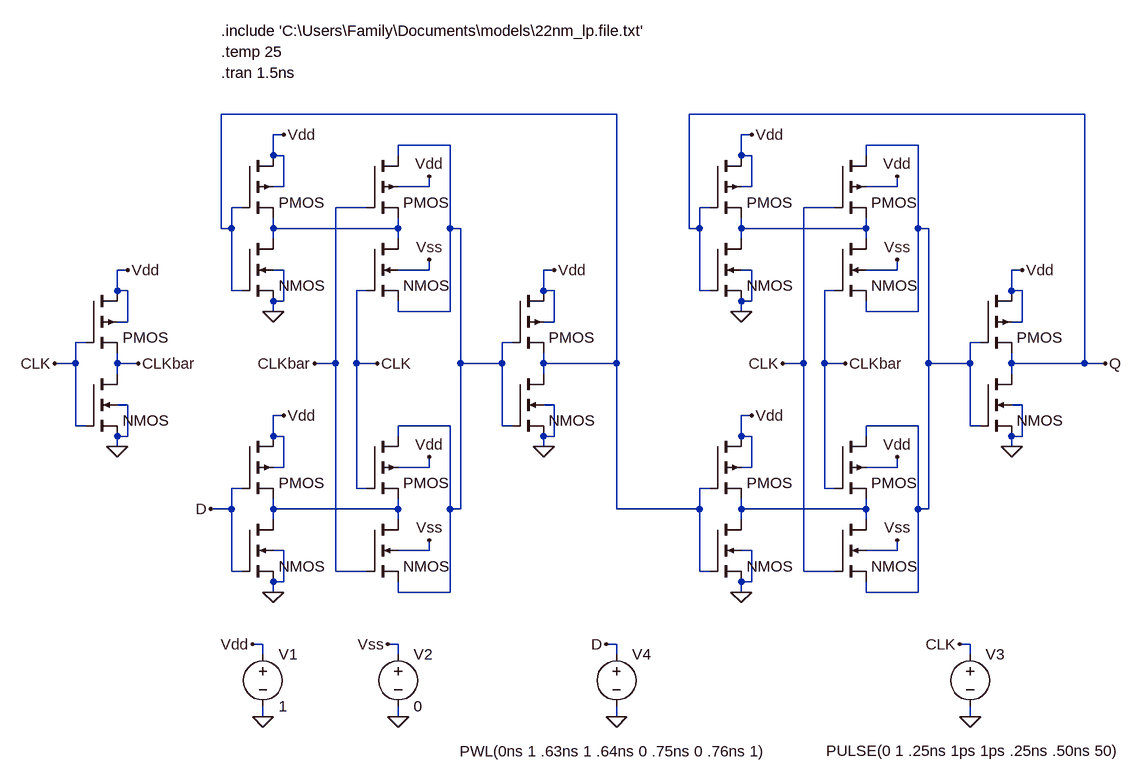
[diagram p0: schematic hw2_q2_b_hold time.asc]
hw2_q2_b_hold time.asc, the LTspice schematic file:
Version 4
SHEET 1 1072 952
WIRE 192 -240 -416 -240
WIRE 912 -240 304 -240
WIRE -320 -208 -336 -208
WIRE 400 -208 384 -208
WIRE -64 -192 -144 -192
WIRE 656 -192 576 -192
WIRE -336 -176 -336 -208
WIRE -320 -176 -336 -176
WIRE -144 -176 -144 -192
WIRE 384 -176 384 -208
WIRE 400 -176 384 -176
WIRE 576 -176 576 -192
WIRE -320 -128 -320 -176
WIRE -320 -128 -336 -128
WIRE -96 -128 -96 -144
WIRE -96 -128 -144 -128
WIRE 400 -128 400 -176
WIRE 400 -128 384 -128
WIRE 624 -128 624 -144
WIRE 624 -128 576 -128
WIRE -384 -96 -400 -96
WIRE -192 -96 -240 -96
WIRE 336 -96 320 -96
WIRE 528 -96 480 -96
WIRE -416 -64 -416 -240
WIRE -400 -64 -400 -96
WIRE -400 -64 -416 -64
WIRE -336 -64 -336 -80
WIRE -144 -64 -144 -80
WIRE -144 -64 -336 -64
WIRE -64 -64 -64 -192
WIRE -48 -64 -64 -64
WIRE 304 -64 304 -240
WIRE 320 -64 320 -96
WIRE 320 -64 304 -64
WIRE 384 -64 384 -80
WIRE 576 -64 576 -80
WIRE 576 -64 384 -64
WIRE 656 -64 656 -192
WIRE 672 -64 656 -64
WIRE -336 -48 -336 -64
WIRE -144 -48 -144 -64
WIRE 384 -48 384 -64
WIRE 576 -48 576 -64
WIRE -560 0 -576 0
WIRE -320 0 -336 0
WIRE -96 0 -96 -16
WIRE -96 0 -144 0
WIRE 96 0 80 0
WIRE 400 0 384 0
WIRE 624 0 624 -16
WIRE 624 0 576 0
WIRE 816 0 800 0
WIRE -576 32 -576 0
WIRE -560 32 -576 32
WIRE -400 32 -400 -64
WIRE -384 32 -400 32
WIRE -192 32 -208 32
WIRE 80 32 80 0
WIRE 96 32 80 32
WIRE 320 32 320 -64
WIRE 336 32 320 32
WIRE 528 32 512 32
WIRE 800 32 800 0
WIRE 816 32 800 32
WIRE -320 48 -320 0
WIRE -320 48 -336 48
WIRE 400 48 400 0
WIRE 400 48 384 48
WIRE -336 64 -336 48
WIRE -144 64 -144 48
WIRE -64 64 -64 -64
WIRE -64 64 -144 64
WIRE 384 64 384 48
WIRE 576 64 576 48
WIRE 656 64 656 -64
WIRE 656 64 576 64
WIRE -560 80 -560 32
WIRE -560 80 -576 80
WIRE 96 80 96 32
WIRE 96 80 80 80
WIRE 816 80 816 32
WIRE 816 80 800 80
WIRE -624 112 -640 112
WIRE 32 112 16 112
WIRE 752 112 736 112
WIRE -640 144 -640 112
WIRE -640 144 -672 144
WIRE -576 144 -576 128
WIRE -544 144 -576 144
WIRE -240 144 -240 -96
WIRE -240 144 -272 144
WIRE -208 144 -208 32
WIRE -176 144 -208 144
WIRE -48 144 -48 -64
WIRE 16 144 16 112
WIRE 16 144 -48 144
WIRE 80 144 80 128
WIRE 192 144 192 -240
WIRE 192 144 80 144
WIRE 480 144 480 -96
WIRE 480 144 448 144
WIRE 512 144 512 32
WIRE 544 144 512 144
WIRE 672 144 672 -64
WIRE 736 144 736 112
WIRE 736 144 672 144
WIRE 800 144 800 128
WIRE 912 144 912 -240
WIRE 912 144 800 144
WIRE 944 144 912 144
WIRE -576 160 -576 144
WIRE 80 160 80 144
WIRE 800 160 800 144
WIRE -560 208 -576 208
WIRE 96 208 80 208
WIRE 816 208 800 208
WIRE -320 224 -336 224
WIRE 400 224 384 224
WIRE -640 240 -640 144
WIRE -624 240 -640 240
WIRE -64 240 -144 240
WIRE 16 240 16 144
WIRE 32 240 16 240
WIRE 656 240 576 240
WIRE 736 240 736 144
WIRE 752 240 736 240
WIRE -560 256 -560 208
WIRE -560 256 -576 256
WIRE -336 256 -336 224
WIRE -320 256 -336 256
WIRE -144 256 -144 240
WIRE 96 256 96 208
WIRE 96 256 80 256
WIRE 384 256 384 224
WIRE 400 256 384 256
WIRE 576 256 576 240
WIRE 816 256 816 208
WIRE 816 256 800 256
WIRE -576 272 -576 256
WIRE 80 272 80 256
WIRE 800 272 800 256
WIRE -320 304 -320 256
WIRE -320 304 -336 304
WIRE -96 304 -96 288
WIRE -96 304 -144 304
WIRE 400 304 400 256
WIRE 400 304 384 304
WIRE 624 304 624 288
WIRE 624 304 576 304
WIRE -384 336 -400 336
WIRE -208 336 -208 144
WIRE -192 336 -208 336
WIRE 336 336 320 336
WIRE 512 336 512 144
WIRE 528 336 512 336
WIRE -400 368 -400 336
WIRE -400 368 -432 368
WIRE -336 368 -336 352
WIRE -144 368 -144 352
WIRE -144 368 -336 368
WIRE -64 368 -64 240
WIRE -48 368 -48 144
WIRE -48 368 -64 368
WIRE 192 368 192 144
WIRE 320 368 320 336
WIRE 320 368 192 368
WIRE 384 368 384 352
WIRE 576 368 576 352
WIRE 576 368 384 368
WIRE 656 368 656 240
WIRE 672 368 672 144
WIRE 672 368 656 368
WIRE -336 384 -336 368
WIRE -144 384 -144 368
WIRE 384 384 384 368
WIRE 576 384 576 368
WIRE -320 432 -336 432
WIRE -96 432 -96 416
WIRE -96 432 -144 432
WIRE 400 432 384 432
WIRE 624 432 624 416
WIRE 624 432 576 432
WIRE -400 464 -400 368
WIRE -384 464 -400 464
WIRE -240 464 -240 144
WIRE -192 464 -240 464
WIRE 320 464 320 368
WIRE 336 464 320 464
WIRE 480 464 480 144
WIRE 528 464 480 464
WIRE -320 480 -320 432
WIRE -320 480 -336 480
WIRE 400 480 400 432
WIRE 400 480 384 480
WIRE -336 496 -336 480
WIRE -144 496 -144 480
WIRE -64 496 -64 368
WIRE -64 496 -144 496
WIRE 384 496 384 480
WIRE 576 496 576 480
WIRE 656 496 656 368
WIRE 656 496 576 496
WIRE -352 576 -368 576
WIRE -144 576 -160 576
WIRE 192 576 176 576
WIRE 736 576 720 576
WIRE -352 592 -352 576
WIRE -144 592 -144 576
WIRE 192 592 192 576
WIRE 736 592 736 576
WIRE -352 688 -352 672
WIRE -144 688 -144 672
WIRE 192 688 192 672
WIRE 736 688 736 672
FLAG -336 64 0
FLAG -352 688 0
FLAG -320 -208 Vdd
FLAG -336 496 0
FLAG -320 224 Vdd
FLAG 80 272 0
FLAG 96 0 Vdd
FLAG 384 64 0
FLAG 400 -208 Vdd
FLAG 384 496 0
FLAG 400 224 Vdd
FLAG 800 272 0
FLAG 816 0 Vdd
FLAG -576 272 0
FLAG -560 0 Vdd
FLAG -432 368 D
FLAG -672 144 CLK
FLAG 944 144 Q
FLAG 736 688 0
FLAG -96 -16 Vss
FLAG -96 416 Vss
FLAG 624 416 Vss
FLAG 624 -16 Vss
FLAG -96 -144 Vdd
FLAG -96 288 Vdd
FLAG 624 -144 Vdd
FLAG 624 288 Vdd
FLAG -144 688 0
FLAG -368 576 Vdd
FLAG -160 576 Vss
FLAG 720 576 CLK
FLAG 176 576 D
FLAG 192 688 0
FLAG -544 144 CLKbar
FLAG -272 144 CLKbar
FLAG 544 144 CLKbar
FLAG -176 144 CLK
FLAG 448 144 CLK
SYMBOL pmos4 -192 -176 R0
WINDOW 0 56 32 Invisible 2
SYMATTR InstName M1
SYMATTR Value2 l=.03u w=1.4u
SYMBOL nmos4 -192 -48 R0
WINDOW 0 56 32 Invisible 2
SYMATTR InstName M2
SYMATTR Value2 l=.03u w=.8u
SYMBOL nmos4 -384 -48 R0
WINDOW 0 56 32 Invisible 2
SYMATTR InstName M3
SYMATTR Value2 l=.03u w=.4u
SYMBOL pmos4 -384 -176 R0
WINDOW 0 56 32 Invisible 2
SYMATTR InstName M4
SYMATTR Value2 l=.03u w=.7u
SYMBOL voltage -352 576 R0
WINDOW 123 0 0 Left 2
WINDOW 39 0 0 Left 2
SYMATTR InstName V1
SYMATTR Value 1
SYMBOL pmos4 -192 256 R0
WINDOW 0 56 32 Invisible 2
SYMATTR InstName M5
SYMATTR Value2 l=.03u w=1.4u
SYMBOL nmos4 -192 384 R0
WINDOW 0 56 32 Invisible 2
SYMATTR InstName M6
SYMATTR Value2 l=.03u w=.8u
SYMBOL nmos4 -384 384 R0
WINDOW 0 56 32 Invisible 2
SYMATTR InstName M7
SYMATTR Value2 l=.03u w=.4u
SYMBOL pmos4 -384 256 R0
WINDOW 0 56 32 Invisible 2
SYMATTR InstName M8
SYMATTR Value2 l=.03u w=.7u
SYMBOL nmos4 32 160 R0
WINDOW 0 56 32 Invisible 2
SYMATTR InstName M9
SYMATTR Value2 l=.03u w=.8u
SYMBOL pmos4 32 32 R0
WINDOW 0 56 32 Invisible 2
SYMATTR InstName M10
SYMATTR Value2 l=.03u w=1.4u
SYMBOL pmos4 528 -176 R0
WINDOW 0 56 32 Invisible 2
SYMATTR InstName M11
SYMATTR Value2 l=.03u w=1.4u
SYMBOL nmos4 528 -48 R0
WINDOW 0 56 32 Invisible 2
SYMATTR InstName M12
SYMATTR Value2 l=.03u w=.8u
SYMBOL nmos4 336 -48 R0
WINDOW 0 56 32 Invisible 2
SYMATTR InstName M13
SYMATTR Value2 l=.03u w=.4u
SYMBOL pmos4 336 -176 R0
WINDOW 0 56 32 Invisible 2
SYMATTR InstName M14
SYMATTR Value2 l=.03u w=.7u
SYMBOL pmos4 528 256 R0
WINDOW 0 56 32 Invisible 2
SYMATTR InstName M15
SYMATTR Value2 l=.03u w=1.4u
SYMBOL nmos4 528 384 R0
WINDOW 0 56 32 Invisible 2
SYMATTR InstName M16
SYMATTR Value2 l=.03u w=.8u
SYMBOL nmos4 336 384 R0
WINDOW 0 56 32 Invisible 2
SYMATTR InstName M17
SYMATTR Value2 l=.03u w=.4u
SYMBOL pmos4 336 256 R0
WINDOW 0 56 32 Invisible 2
SYMATTR InstName M18
SYMATTR Value2 l=.03u w=.7u
SYMBOL nmos4 752 160 R0
WINDOW 0 56 32 Invisible 2
SYMATTR InstName M19
SYMATTR Value2 l=.03u w=.8u
SYMBOL pmos4 752 32 R0
WINDOW 0 56 32 Invisible 2
SYMATTR InstName M20
SYMATTR Value2 l=.03u w=1.4u
SYMBOL nmos4 -624 160 R0
WINDOW 0 56 32 Invisible 2
SYMATTR InstName M21
SYMATTR Value2 l=.03u w=.4u
SYMBOL pmos4 -624 32 R0
WINDOW 0 56 32 Invisible 2
SYMATTR InstName M22
SYMATTR Value2 l=.03u w=.7u
SYMBOL voltage 736 576 R0
WINDOW 3 -221 164 Left 2
WINDOW 123 0 0 Left 2
WINDOW 39 0 0 Left 2
SYMATTR Value PULSE(0 1 .25ns 1ps 1ps .25ns .50ns 50)
SYMATTR InstName V3
SYMBOL voltage -144 576 R0
WINDOW 123 0 0 Left 2
WINDOW 39 0 0 Left 2
SYMATTR InstName V2
SYMATTR Value 0
SYMBOL voltage 192 576 R0
WINDOW 3 -241 165 Left 2
WINDOW 123 0 0 Left 2
WINDOW 39 0 0 Left 2
SYMATTR Value PWL(0ns 1 .63ns 1 .64ns 0 .75ns 0 .76ns 1)
SYMATTR InstName V4
TEXT -416 -368 Left 2 !.include 'C:\\Users\\Family\\Documents\\models\\22nm_lp.file.txt'
TEXT -416 -304 Left 2 !.tran 1.5ns
TEXT -416 -336 Left 2 !.temp 25

The netlist it stands for:
* hw2_q2_b_hold time.asc
M1 N002 CLKbar N004 Vdd PMOS l=.03u w=1.4u
M2 N004 CLK N002 Vss NMOS l=.03u w=.8u
M3 N004 N001 0 0 NMOS l=.03u w=.4u
M4 Vdd N001 N004 Vdd PMOS l=.03u w=.7u
V1 Vdd 0 1
M5 N002 CLK N006 Vdd PMOS l=.03u w=1.4u
M6 N006 CLKbar N002 Vss NMOS l=.03u w=.8u
M7 N006 D 0 0 NMOS l=.03u w=.4u
M8 Vdd D N006 Vdd PMOS l=.03u w=.7u
M9 N001 N002 0 0 NMOS l=.03u w=.8u
M10 Vdd N002 N001 Vdd PMOS l=.03u w=1.4u
M11 N003 CLK N005 Vdd PMOS l=.03u w=1.4u
M12 N005 CLKbar N003 Vss NMOS l=.03u w=.8u
M13 N005 Q 0 0 NMOS l=.03u w=.4u
M14 Vdd Q N005 Vdd PMOS l=.03u w=.7u
M15 N003 CLKbar N007 Vdd PMOS l=.03u w=1.4u
M16 N007 CLK N003 Vss NMOS l=.03u w=.8u
M17 N007 N001 0 0 NMOS l=.03u w=.4u
M18 Vdd N001 N007 Vdd PMOS l=.03u w=.7u
M19 Q N003 0 0 NMOS l=.03u w=.8u
M20 Vdd N003 Q Vdd PMOS l=.03u w=1.4u
M21 CLKbar CLK 0 0 NMOS l=.03u w=.4u
M22 Vdd CLK CLKbar Vdd PMOS l=.03u w=.7u
V3 CLK 0 PULSE(0 1 .25ns 1ps 1ps .25ns .50ns 50)
V2 Vss 0 0
V4 D 0 PWL(0ns 1 .63ns 1 .64ns 0 .75ns 0 .76ns 1)
.model NMOS NMOS
.model PMOS PMOS
.lib standard.mos
.include 'C:\Users\Family\Documents\models\22nm_lp.file.txt'
.tran 1.5ns
.temp 25
.backanno
.end